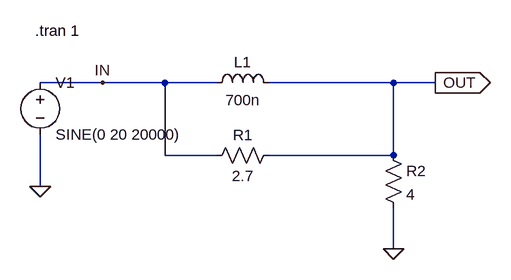
[diagram p0: schematic output_current.asc]
output_current.asc, the LTspice schematic file:
Version 4
SHEET 1 880 680
WIRE 144 256 48 256
WIRE 240 256 144 256
WIRE 320 256 240 256
WIRE 592 256 400 256
WIRE 656 256 592 256
WIRE 240 368 240 256
WIRE 320 368 240 368
WIRE 592 368 592 256
WIRE 592 368 400 368
WIRE 48 416 48 336
WIRE 592 512 592 448
FLAG 48 416 0
FLAG 592 512 0
FLAG 656 256 OUT
IOPIN 656 256 Out
FLAG 144 256 IN
SYMBOL ind 304 272 R270
WINDOW 0 32 56 VTop 2
WINDOW 3 5 56 VBottom 2
SYMATTR InstName L1
SYMATTR Value 700n
SYMBOL res 416 352 R90
WINDOW 0 0 56 VBottom 2
WINDOW 3 32 56 VTop 2
SYMATTR InstName R1
SYMATTR Value 2.7
SYMBOL voltage 48 240 R0
SYMATTR InstName V1
SYMATTR Value SINE(0 20 20000)
SYMBOL res 576 352 R0
SYMATTR InstName R2
SYMATTR Value 4
TEXT 40 176 Left 2 !.tran 1

The netlist it stands for:
* output_current.asc
L1 IN OUT 700n
R1 OUT IN 2.7
V1 IN 0 SINE(0 20 20000)
R2 OUT 0 4
.tran 1
.backanno
.end